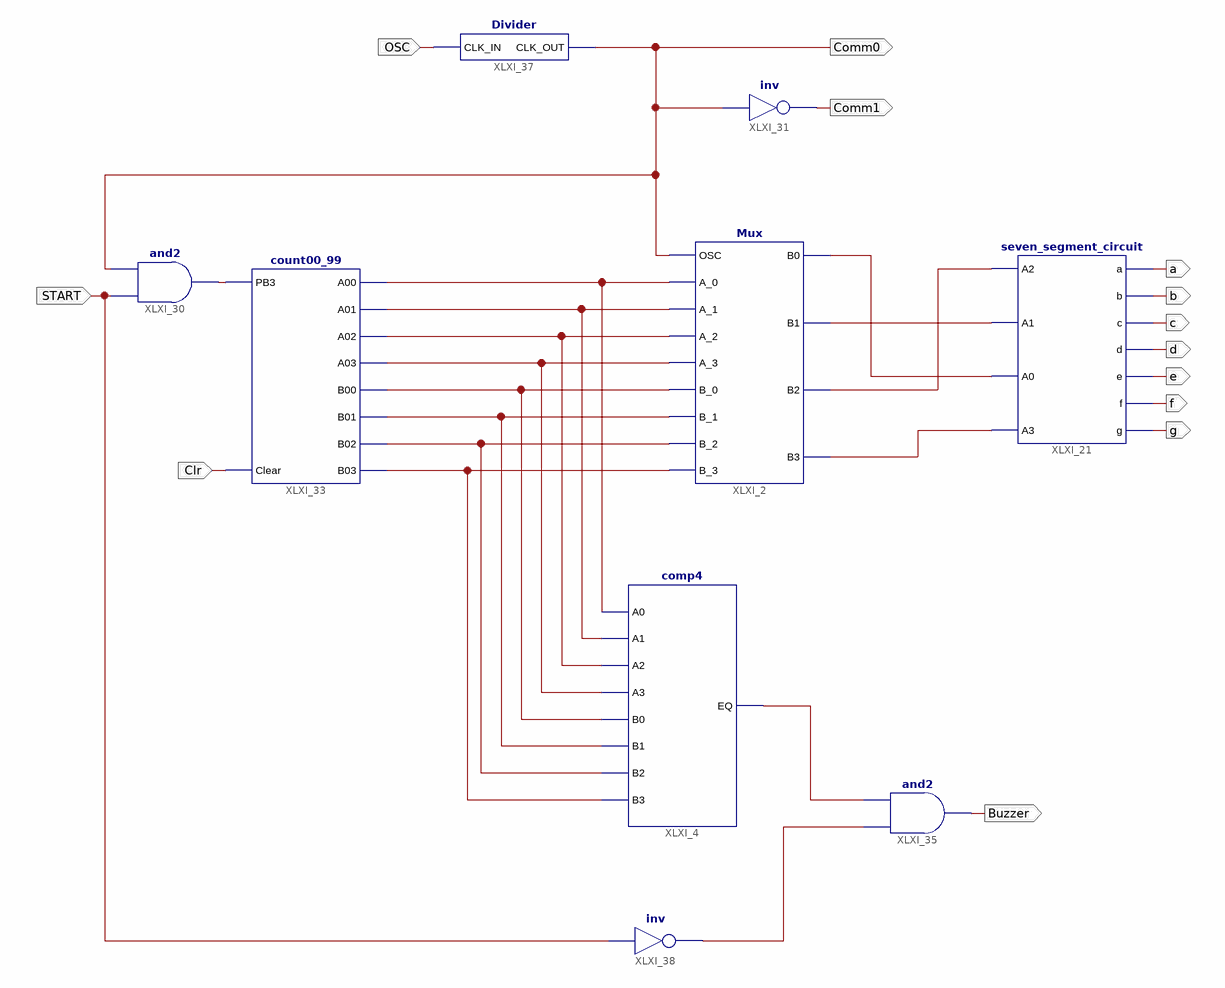
[diagram p0: schematic sheet 1]
// Xilinx ISE schematic CountOnSevenSeg.sch (spartan6) as structural Verilog: 9 symbols, 13 ports
module CountOnSevenSeg (
  input  Clr,
  input  OSC,
  input  START,
  output a,
  output b,
  output c,
  output d,
  output e,
  output f,
  output g,
  output Comm1,
  output Comm0,
  output Buzzer
);

  wire XLXN_5, XLXN_7, XLXN_12, XLXN_22, XLXN_23, XLXN_24, XLXN_25, XLXN_26, XLXN_70, XLXN_71, XLXN_72,
       XLXN_73, XLXN_94, XLXN_114, XLXN_116;

  comp4 XLXI_4 (
    .A0(XLXN_5), .A1(XLXN_7), .A2(XLXN_12), .A3(XLXN_22), .B0(XLXN_23), .B1(XLXN_24), .B2(XLXN_25),
    .B3(XLXN_26), .EQ(XLXN_114));
  Mux XLXI_2 (
    .OSC(Comm0), .A_0(XLXN_5), .A_1(XLXN_7), .A_2(XLXN_12), .A_3(XLXN_22), .B_0(XLXN_23), .B_1(XLXN_24),
    .B_2(XLXN_25), .B_3(XLXN_26), .B0(XLXN_70), .B1(XLXN_71), .B2(XLXN_72), .B3(XLXN_73));
  seven_segment_circuit XLXI_21 (
    .A2(XLXN_72), .A1(XLXN_71), .A0(XLXN_70), .A3(XLXN_73), .a(a), .b(b), .c(c), .d(d), .e(e), .f(f), .g(g));
  and XLXI_30 (XLXN_94, START, Comm0);
  not XLXI_31 (Comm1, Comm0);
  count00_99 XLXI_33 (
    .PB3(XLXN_94), .Clear(Clr), .A00(XLXN_5), .A01(XLXN_7), .A02(XLXN_12), .A03(XLXN_22), .B00(XLXN_23),
    .B01(XLXN_24), .B02(XLXN_25), .B03(XLXN_26));
  and XLXI_35 (Buzzer, XLXN_116, XLXN_114);
  Divider XLXI_37 (.CLK_IN(OSC), .CLK_OUT(Comm0));
  not XLXI_38 (XLXN_116, START);

  // Notes on the sheet:
  //   LOC on signal Clr = P46
  //   LOC on signal a = P41
  //   LOC on signal b = P40
  //   LOC on signal c = P35
  //   LOC on signal d = P34
  //   LOC on signal e = P32
  //   LOC on signal f = P29
  //   LOC on signal g = P27
  //   LOC on signal OSC = P123
  //   LOC on signal Comm1 = P43
  //   LOC on signal Comm0 = P44
  //   LOC on signal Buzzer = P83
  //   LOC on signal START = P47
endmodule
